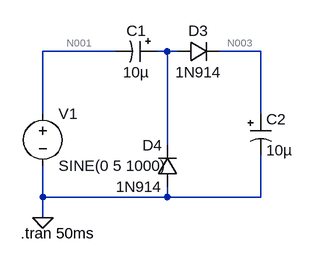
[diagram p0: schematic double_V.asc]
double_V.asc, the LTspice schematic file:
Version 4
SHEET 1 1140 680
WIRE 32 64 -80 64
WIRE 112 64 96 64
WIRE 128 64 112 64
WIRE 256 64 192 64
WIRE -80 160 -80 64
WIRE 256 160 256 64
WIRE 112 208 112 64
WIRE -80 288 -80 240
WIRE 112 288 112 272
WIRE 112 288 -80 288
WIRE 256 288 256 224
WIRE 256 288 112 288
WIRE -80 320 -80 288
FLAG -80 320 0
SYMBOL voltage -80 144 R0
WINDOW 123 0 0 Left 2
WINDOW 39 0 0 Left 2
SYMATTR InstName V1
SYMATTR Value SINE(0 5 1000)
SYMBOL diode 128 80 R270
WINDOW 0 32 32 VTop 2
WINDOW 3 0 32 VBottom 2
SYMATTR InstName D3
SYMATTR Value 1N914
SYMBOL diode 128 272 R180
WINDOW 0 24 64 Left 2
WINDOW 3 24 0 Left 2
SYMATTR InstName D4
SYMATTR Value 1N914
SYMBOL polcap 96 48 R90
WINDOW 0 0 32 VBottom 2
WINDOW 3 32 32 VTop 2
SYMATTR InstName C1
SYMATTR Value 10µ
SYMBOL polcap 240 160 R0
SYMATTR InstName C2
SYMATTR Value 10µ
TEXT -114 344 Left 2 !.tran 50ms

The netlist it stands for:
* double_V.asc
V1 N001 0 SINE(0 5 1000)
D3 N002 N003 1N914
D4 0 N002 1N914
C1 N002 N001 10µ
C2 N003 0 10µ
.model D D
.lib standard.dio
.tran 50ms
.backanno
.end

* Results of the author's LTspice run, read from the files saved beside the schematic
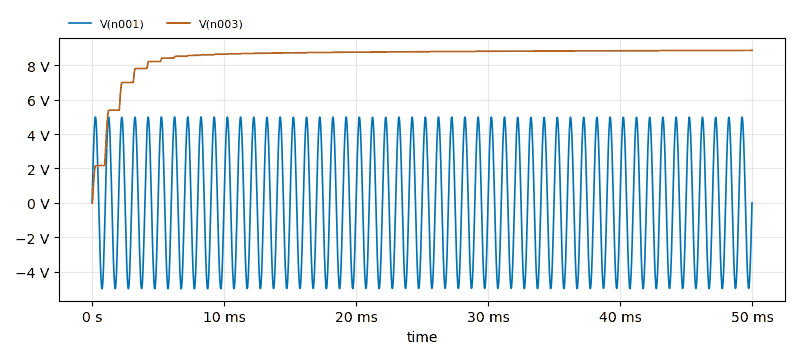
[diagram p1: Transient Analysis of double_V.asc, plotted from the saved traces]
* Transient Analysis, 1 run:
*   V(n001): min -4.997 V, max 4.997 V, average -948 µV, rms 3.503 V, last 0 V
*   V(n003): min 0 V, max 8.868 V, average 8.485 V, rms 8.559 V, last 8.868 V